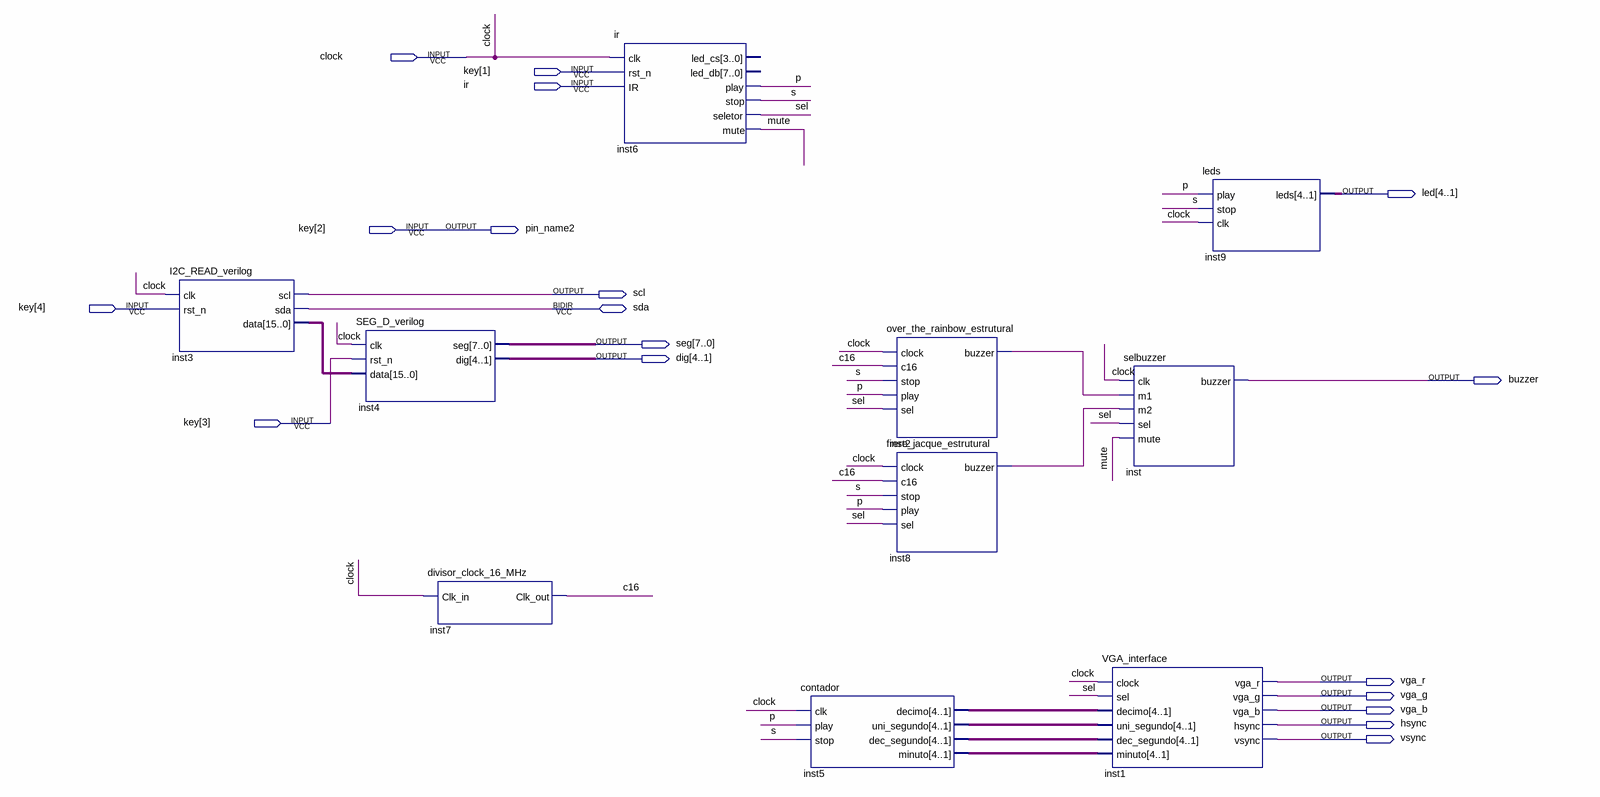
[diagram p0: schematic sheet]
// Quartus schematic projeto4.bdf as structural Verilog: 10 symbols, 18 pins
module projeto4 (
  input  clock,
  input  [4:1] key,
  input  ir,
  inout  sda,
  output [4:1] led,
  output pin_name2,
  output scl,
  output [7:0] seg,
  output [4:1] dig,
  output buzzer,
  output vga_r,
  output vga_g,
  output vga_b,
  output hsync,
  output vsync
);

  wire c16, inst2_buzzer, inst8_buzzer, mute, p, s, sel;
  wire [3:0] inst5_dec_segundo, inst5_decimo, inst5_minuto, inst5_uni_segundo;
  wire [15:0] inst3_data;

  I2C_READ_verilog inst3 (.clk(clock), .rst_n(key[4]), .scl(scl), .data(inst3_data), .sda(sda));
  SEG_D_verilog inst4 (.clk(clock), .rst_n(key[3]), .data(inst3_data), .seg(seg), .dig(dig));
  divisor_clock_16_MHz inst7 (.Clk_in(clock), .Clk_out(c16));
  ir inst6 (
    .clk(clock), .rst_n(key[1]), .IR(ir), .play(p), .stop(s), .seletor(sel), .mute(mute));  // open: led_cs, led_db
  contador inst5 (
    .clk(clock), .play(p), .stop(s), .decimo(inst5_decimo), .uni_segundo(inst5_uni_segundo),
    .dec_segundo(inst5_dec_segundo), .minuto(inst5_minuto));
  over_the_rainbow_estrutural inst2 (.clock(clock), .c16(c16), .stop(s), .play(p), .sel(sel), .buzzer(inst2_buzzer));
  frere_jacque_estrutural inst8 (.clock(clock), .c16(c16), .stop(s), .play(p), .sel(sel), .buzzer(inst8_buzzer));
  VGA_interface inst1 (
    .clock(clock), .sel(sel), .decimo(inst5_decimo), .uni_segundo(inst5_uni_segundo),
    .dec_segundo(inst5_dec_segundo), .minuto(inst5_minuto), .vga_r(vga_r), .vga_g(vga_g), .vga_b(vga_b),
    .hsync(hsync), .vsync(vsync));
  selbuzzer inst (.clk(clock), .m1(inst2_buzzer), .m2(inst8_buzzer), .sel(sel), .mute(mute), .buzzer(buzzer));
  leds inst9 (.play(p), .stop(s), .clk(clock), .leds(led));

  assign pin_name2 = key[2];
endmodule
